# EAGLE design rpi2_brkout (EAGLE 7.7.0)
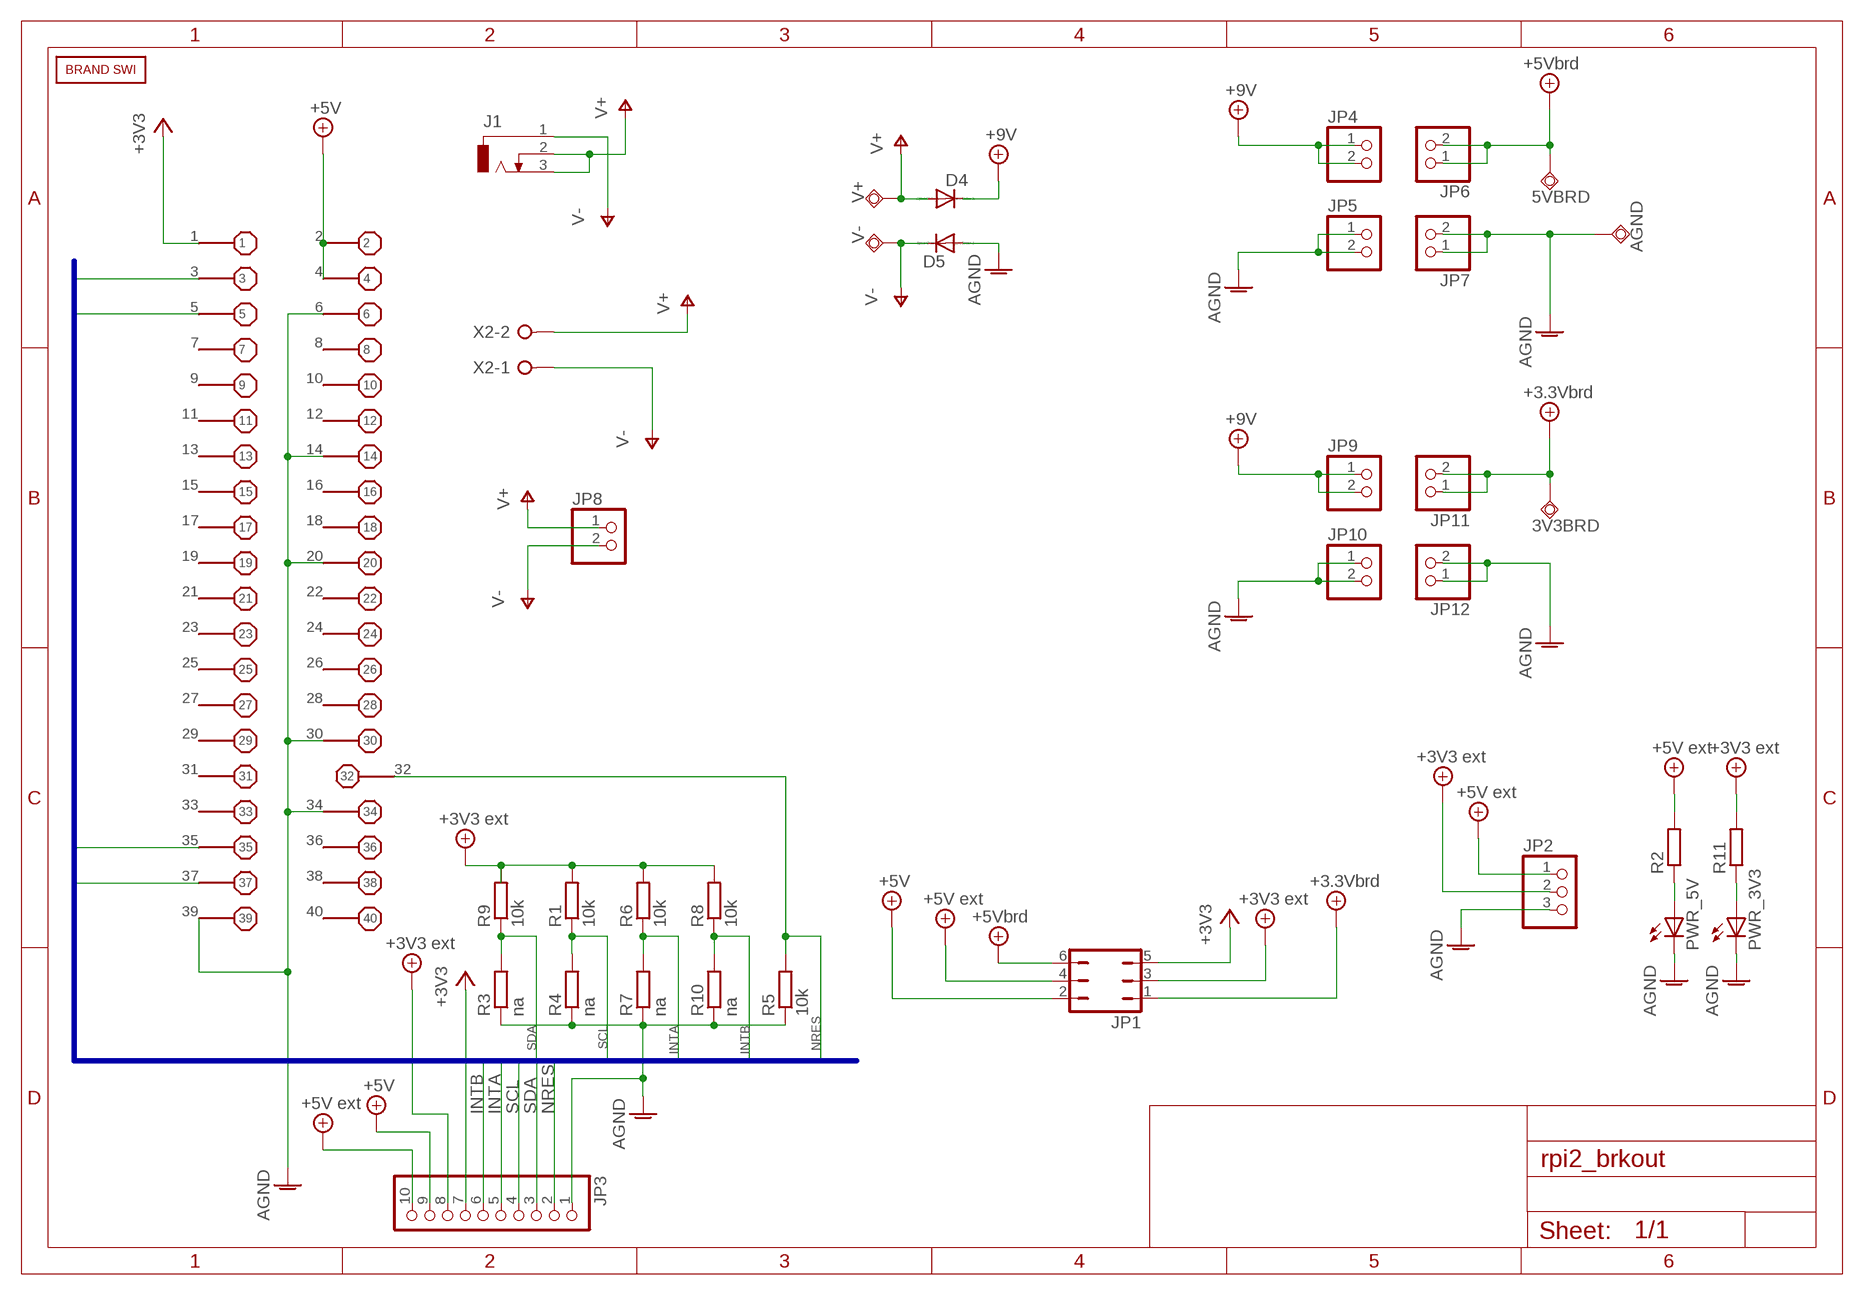
[diagram p0: schematic, sheet 1]

## Parts
3V3BRD  TPSQTP20SQ  [TP20SQ]
5VBRD  TPSQTP20SQ  [TP20SQ]
AGND  TPSQTP20SQ  [TP20SQ]
D4  1N4148DO35-7  [DO35-7]
D5  1N4148DO35-7  [DO35-7]
J1  DCJ0303  [DCJ0303]
JP1  JP3Q  [JP3Q]
JP2  PINHD-1X3  [1X03]
JP3  PINHD-1X10  [1X10]
JP4  PINHD-1X2  [1X02]
JP5  PINHD-1X2  [1X02]
JP6  PINHD-1X2  [1X02]
JP7  PINHD-1X2  [1X02]
JP8  PINHD-1X2  [1X02]
JP9  PINHD-1X2  [1X02]
JP10  PINHD-1X2  [1X02]
JP11  PINHD-1X2  [1X02]
JP12  PINHD-1X2  [1X02]
PWR_3V3  LEDCHIP-LED0805  [CHIP-LED0805]
PWR_5V  LEDCHIP-LED0805  [CHIP-LED0805]
R1  10k  R-EU_R0805  [R0805]
R2  R-EU_R0805  [R0805]
R3  na  R-EU_R0805  [R0805]
R4  na  R-EU_R0805  [R0805]
R5  10k  R-EU_R0805  [R0805]
R6  10k  R-EU_R0805  [R0805]
R7  na  R-EU_R0805  [R0805]
R8  10k  R-EU_R0805  [R0805]
R9  10k  R-EU_R0805  [R0805]
R10  na  R-EU_R0805  [R0805]
R11  R-EU_R0805  [R0805]
U$1  BRAND_SWI  [BRAND_SWI]
V+  TPSQTP20SQ  [TP20SQ]
V-  TPSQTP20SQ  [TP20SQ]
X1  B+_GPIO  [B+_GPIO]
X2  W237-02P  [W237-132]

## Nets
3.3VEXT: R1.2 R6.2 R8.2 R9.2 ; supply symbol labelled +3V3 ext
+3V3: JP1.5 JP3.7 X1.1
+5V: JP1.2 JP3.9 X1.2 X1.4
+5V/1: JP1.4 JP2.1 JP3.10 R2.2 ; supply symbol labelled +5V ext
+5V/2: JP1.3 JP2.2 JP3.8 R11.2 ; supply symbol labelled +3V3 ext
+5V/3: 3V3BRD.TP JP1.1 JP11.1 JP11.2 ; supply symbol labelled +3.3Vbrd
+5V/4: 5VBRD.TP JP1.6 JP6.1 JP6.2 ; supply symbol labelled +5Vbrd
+9V: D4.C JP4.1 JP4.2 JP9.1 JP9.2
AGND: AGND.TP D5.A JP2.3 JP3.1 JP5.1 JP5.2 JP7.1 JP7.2 JP10.1 JP10.2 JP12.1 JP12.2 PWR_3V3.C PWR_5V.C R3.1 R4.1 R5.1 R7.1 R10.1 X1.6 X1.14 X1.20 X1.30 X1.34 X1.39
INTA: JP3.5 R6.1 R7.2 X1.37
INTB: JP3.6 R8.1 R10.2 X1.35
N$1: PWR_3V3.A R11.1
N$31: PWR_5V.A R2.1
NRES: JP3.2 R5.2 X1.32
SCL: JP3.4 R1.1 R4.2 X1.5
SDA: JP3.3 R3.2 R9.1 X1.3
V+: D4.A J1.2 J1.3 JP8.1 V+.TP X2.2
V-: D5.C J1.1 JP8.2 V-.TP X2.1
Unconnected: X1.7 X1.8 X1.9 X1.10 X1.11 X1.12 X1.13 X1.15 X1.16 X1.17 X1.18 X1.19 X1.21 X1.22 X1.23 X1.24 X1.25 X1.26 X1.27 X1.28 X1.29 X1.31 X1.33 X1.36 X1.38 X1.40

## Buses
INTA,INTB,SCL,SDA,NRES

## Library data of the parts
3V3BRD 5VBRD AGND V+ V- = testpad:TPSQ: Test pad
D4 D5 = diode:1N4148: DIODE high speed (Philips)
J1 = con-jack:DCJ0303: DC POWER JACK Source: DCJ0303.pdf; OC_FARNELL: unknown; OC_NEWARK: unknown
JP1 = jumper:JP3Q: JUMPER
JP2 = pinhead:PINHD-1X3: PIN HEADER
JP3 = pinhead:PINHD-1X10: PIN HEADER
JP4-JP12 = pinhead:PINHD-1X2: PIN HEADER
PWR_3V3 PWR_5V = led:LED: LED OSRAM: - CHIPLED LG R971, LG N971, LY N971, LG Q971, LY Q971, LO R971, LY R971 LH N974, LH R974 LS Q976, LO Q976, LY Q976 LO Q996 - Hyper CHIPLED LW Q18S LB Q993, LB Q99A, LB R99A - SideLED LS A670, LO A670, LY A670, LG A670, LP A670 LB A673, LV A673, LT A673, LW A673 LH A674 LY A675 LS A676, LA A676, LO A676, LY A676, LW A676 LS A679, LY A679, LG A679 - Hyper Micro SIDELED® LS Y876, LA Y876, LO Y876, LY Y876 LT Y87S - SmartLED LW L88C, LW L88S LB L89C, LB L89S, LG L890 LS L89K, LO L89K, LY L89K LS L896, LA L896, LO L896, LY L896 - TOPLED LS T670, LO T670, LY T670, LG T670, LP T670 LSG T670, LSP T670, LSY T670, LOP T670, LYG T670 LG T671, LOG T671, LSG T671 LB T673, LV T673, LT T673, LW T673 LH T674 LS T676, LA T676, LO T676, LY T676, LB T676, LH T676, LSB T676, LW T676 LB T67C, LV T67C, LT T67C, LS T67K, LO T67K, LY T67K, LW E67C LS E67B, LA E67B, LO E67B, LY E67B, LB E67C, LV E67C, LT E67C LW T67C LS T679, LY T679, LG T679 LS T770, LO T770, LY T770, LG T770, LP T770 LB T773, LV T773, LT T773, LW T773 LH T774 LS E675, LA E675, LY E675, LS T675 LS T776, LA T776, LO T776, LY T776, LB T776 LHGB T686 LT T68C, LB T68C - Hyper Mini TOPLED® LB M676 - Mini TOPLED Santana® LG M470 LS M47K, LO M47K, LY M47K Source: http://www.osram.convergy.de LUXEON: - LUMILED® LXK2-PW12-R00, LXK2-PW12-S00, LXK2-PW14-U00, LXK2-PW14-V00 LXK2-PM12-R00, LXK2-PM12-S00, LXK2-PM14-U00 LXK2-PE12-Q00, LXK2-PE12-R00, LXK2-PE12-S00, LXK2-PE14-T00, LXK2-PE14-U00 LXK2-PB12-K00, LXK2-PB12-L00, LXK2-PB12-M00, LXK2-PB14-N00, LXK2-PB14-P00, LXK2-PB14-Q00 LXK2-PR12-L00, LXK2-PR12-M00, LXK2-PR14-Q00, LXK2-PR14-R00 LXK2-PD12-Q00, LXK2-PD12-R00, LXK2-PD12-S00 LXK2-PH12-R00, LXK2-PH12-S00 LXK2-PL12-P00, LXK2-PL12-Q00, LXK2-PL12-R00 Source: www.luxeon.com KINGBRIGHT: KA-3528ASYC Source: www.kingbright.com
R1-R11 = rcl:R-EU_: RESISTOR, European symbol
U$1 = BRAND_SWI:BRAND_SWI
X1 = raspberry:B+_GPIO
X2 = con-wago-508:W237-02P: WAGO SREW CLAMP; OC_FARNELL: unknown; OC_NEWARK: unknown

## Board
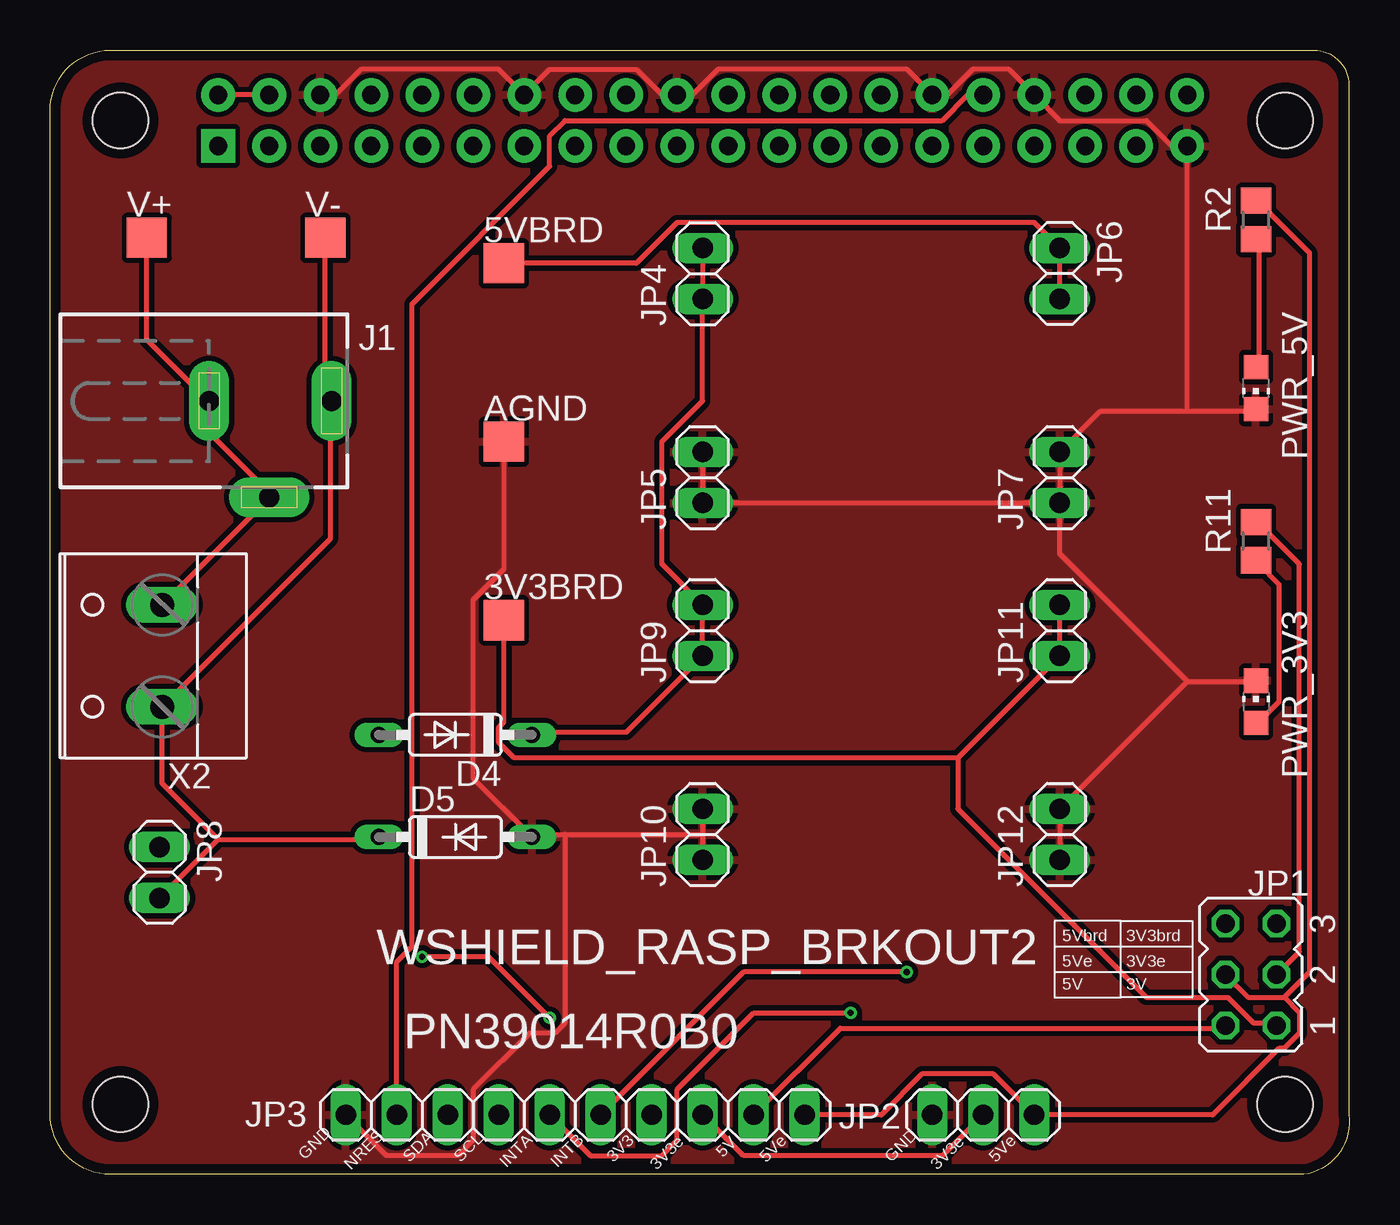
[diagram p1: board, top side]
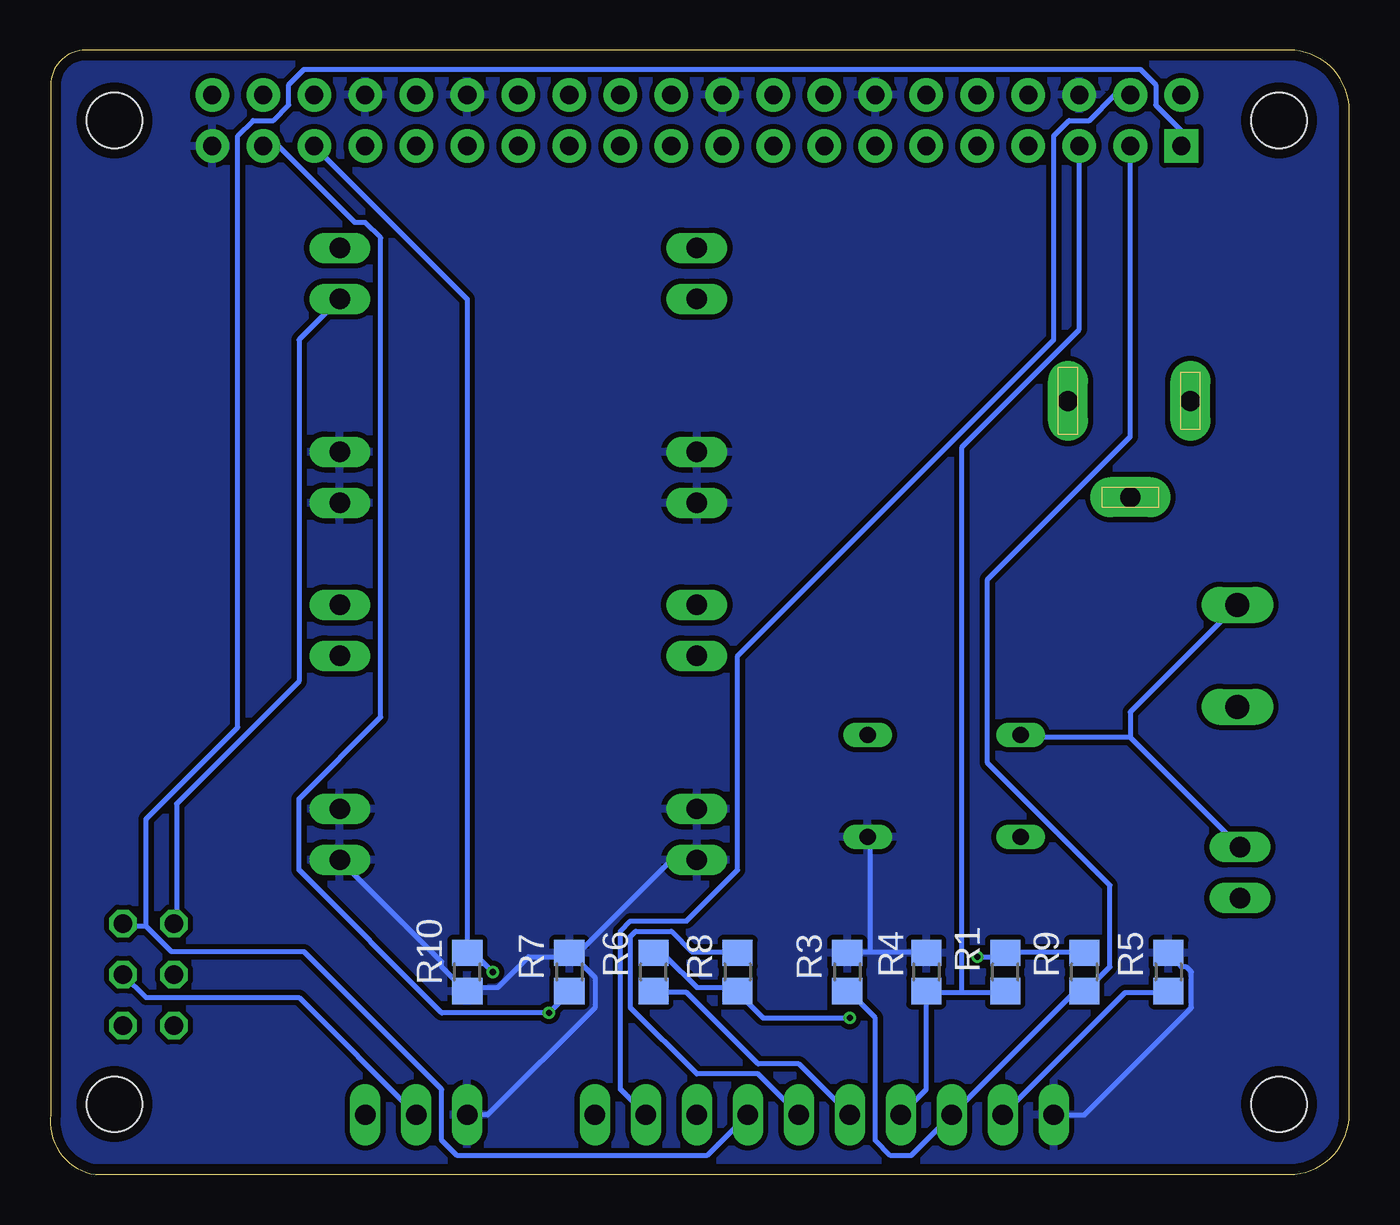
[diagram p2: board, bottom side, seen from below]

Size 64.71 x 56 mm. Coordinates in mm from the lower left corner, seen from the top.
Outline: 0,53 arc-90 3,56 62.95,56 arc-90 64.68,54.27 64.68,3 arc-90 62.44,0 3,0 arc-90 0,3 0,53
Copper layers (1*16): Top 0.035mm / dielectric 1.6mm / Bottom 0.035mm
Design rules "Elecrow_2-layer_PCB_eagle_rule *": minimum track width 10mil, minimum drill 12mil, track to track 10mil, track to pad 10mil, pad to pad 6mil, via to via 8mil, smd to smd 0mil, copper to edge 20mil, drill to drill 10mil, minimum pad ring 6mil, minimum via ring 6mil, stop-mask expansion 0mil, vias tented up to drill 100mil, thermal gap 10mil
Holes 2.75 mm at 3.5,52.5 3.5,3.5 61.5,52.5 61.5,3.5

### Footprints (pad centres in the part's own frame; a part is rotated, then mirrored left to right if it is on the bottom)
TP20SQ = smd 2 x 2: TP 0,0
DO35-7 = drill 0.813 long: A 3.81,0; C -3.81,0
DCJ0303 = drill 1 pad 2 long: 1 0,3.1; 2 4.8,0; 3 0,-3
JP3Q = drill 0.914 octagon: 1 -2.54,-1.27; 2 -2.54,1.27; 3 0,-1.27; 4 0,1.27; 5 2.54,-1.27; 6 2.54,1.27
1X03 = drill 1.016 long: 1 -2.54,0; 2 0,0; 3 2.54,0
1X10 = drill 1.016 long: 1 -11.43,0; 2 -8.89,0; 3 -6.35,0; 4 -3.81,0; 5 -1.27,0; 6 1.27,0; 7 3.81,0; 8 6.35,0; 9 8.89,0; 10 11.43,0
1X02 = drill 1.016 long: 1 -1.27,0; 2 1.27,0
CHIP-LED0805 = smd 1.2 x 1.2: A 0,-1.05; C 0,1.05
R0805 = smd 1.3 x 1.5: 1 -0.95,0; 2 0.95,0
B+_GPIO = drill 0.9 pad 1.676 square: 1 -24.13,-1.27 | drill 0.9 pad 1.676: 2 -24.13,1.27; 3 -21.59,-1.27; 4 -21.59,1.27; 5 -19.05,-1.27; 6 -19.05,1.27; 7 -16.51,-1.27; 8 -16.51,1.27; 9 -13.97,-1.27; 10 -13.97,1.27; 11 -11.43,-1.27; 12 -11.43,1.27; 13 -8.89,-1.27; 14 -8.89,1.27; 15 -6.35,-1.27; 16 -6.35,1.27; 17 -3.81,-1.27; 18 -3.81,1.27; 19 -1.27,-1.27; 20 -1.27,1.27; 21 1.27,-1.27; 22 1.27,1.27; 23 3.81,-1.27; 24 3.81,1.27; 25 6.35,-1.27; 26 6.35,1.27; 27 8.89,-1.27; 28 8.89,1.27; 29 11.43,-1.27; 30 11.43,1.27; 31 13.97,-1.27; 32 13.97,1.27; 33 16.51,-1.27; 34 16.51,1.27; 35 19.05,-1.27; 36 19.05,1.27; 37 21.59,-1.27; 38 21.59,1.27; 39 24.13,-1.27; 40 24.13,1.27
W237-132 = drill 1.194 long: 1 -2.54,-0.635; 2 2.54,-0.635

### Placement (x,y rotation side)
3V3BRD  22.59,27.61 0 top
5VBRD  22.59,45.39 0 top
AGND  22.59,36.5 0 top
D4  20.18,21.89 180 top
D5  20.18,16.81 0 top
J1  10.91,38.53 270 top
JP1  59.8,9.96 90 top
JP2  46.47,2.97 180 top
JP3  26.15,2.97 0 top
JP4  32.5,44.88 90 top
JP5  32.5,34.72 90 top
JP6  50.28,44.88 270 top
JP7  50.28,34.72 90 top
JP8  5.45,15.04 270 top
JP9  32.5,27.1 90 top
JP10  32.5,16.94 90 top
JP11  50.28,27.1 90 top
JP12  50.28,16.94 90 top
PWR_3V3  60.06,23.54 0 top
PWR_5V  60.06,39.16 180 top
R1  17.13,10.08 90 bottom
R2  60.06,47.55 90 top
R3  25.01,10.08 270 bottom
R4  21.07,10.08 270 bottom
R5  9,10.08 270 bottom
R6  34.66,10.08 90 bottom
R7  38.85,10.08 270 bottom
R8  30.47,10.08 270 bottom
R9  13.2,10.08 90 bottom
R10  43.93,10.08 90 bottom
R11  60.06,31.55 90 top
U$1  8.75,6.15 0 top
V+  4.81,46.66 0 top
V-  13.7,46.66 0 top
X1  32.5,52.5 0 top
X2  4.94,25.83 90 top

### Tracks (layer width: path | path; a pad name or v marks a point on that pad's centre or on a via)
3.3VEXT  (via drill 0.3)
  Top 0.254: v18.53,10.84 21.83,10.84 v24.88,7.8
  Bottom 0.254: R9.2 13.2,11.1 17.01,11.1 R1.2 17.26,10.84 v18.53,10.84 | R6.2 34.53,10.84 34.02,10.84 32.5,9.32 30.47,9.32 R8.2 30.47,9.07 29.2,7.8 v24.88,7.8
+3V3
  Bottom 0.254: 59.93,12.37 60.95,12.37 JP1.5 | 59.93,12.37 58.66,11.1 52.06,11.1 45.2,4.24 45.2,1.7 44.44,0.94 31.99,0.94 JP3.7 | X1.1 8.37,51.99 9.64,53.26 9.64,54.28 10.4,55.04 52.06,55.04 52.82,54.28 52.82,53.26 53.58,52.5 54.6,52.5 55.36,51.74 55.36,22.27 59.93,17.7 59.93,12.37
+5V
  Top 0.254: X1.4 X1.2 | JP3.9 39.36,7.29 58.41,7.29 JP1.2
  Bottom 0.254: X1.4 11.67,53.77 12.94,52.5 13.96,52.5 14.72,51.74 14.72,41.58 30.47,25.83 30.47,15.16 33.01,12.62 35.8,12.62 36.31,12.11 36.31,4.24 JP3.9
+5V/1
  Top 0.254: JP3.10 41.39,2.97 43.42,5 46.98,5 JP2.1 57.9,2.97 61.2,6.27 61.46,6.27 62.22,7.03 62.22,8.05 61.46,8.81 | 61.46,8.81 62.73,10.08 62.73,45.9 60.19,48.44 R2.2 | 61.46,8.81 59.68,8.81 JP1.4
+5V/2
  Top 0.254: JP3.8 34.53,0.94 44.44,0.94 JP2.2 | JP1.3 62.22,11.1 62.22,30.4 60.19,32.43 R11.2
  Bottom 0.254: JP2.2 52.31,8.81 59.93,8.81 JP1.3
+5V/3
  Top 0.254: 61.2,7.44 JP1.1 60.95,7.54 59.93,7.54 58.66,8.81 54.6,8.81 45.2,18.21 45.2,20.75 | 3V3BRD.TP 22.59,22.53 22.34,22.27 22.34,21.51 23.1,20.75 45.2,20.75 | 45.2,20.75 JP11.1 JP11.2
+5V/4
  Top 0.254: 5VBRD.TP 29.2,45.39 31.23,47.42 49.01,47.42 JP6.1 JP6.2
  Bottom 0.254: JP6.2 52.31,41.58 52.31,24.56 58.41,18.46 58.41,12.62 JP1.6
+9V
  Top 0.254: JP4.2 JP4.1 32.5,38.53 30.47,36.5 30.47,30.4 JP9.2 JP9.1 28.69,22.02 24.12,22.02 D4.C
AGND
  Top 0.254: X1.6 14.21,53.77 15.48,55.04 22.34,55.04 X1.14 24.88,55.04 29.2,55.04 30.47,53.77 X1.20 31.99,53.77 33.26,55.04 42.66,55.04 X1.30 44.69,53.77 45.96,55.04 47.74,55.04 X1.34 50.28,52.5 54.6,52.5 55.87,51.23 X1.39 56.63,38.02 | JP5.2 JP5.1 JP7.1 | 56.63,38.02 52.31,38.02 JP7.2 JP7.1 | 56.63,38.02 59.93,38.02 PWR_5V.C | 56.63,24.56 59.93,24.56 PWR_3V3.C | 56.63,24.56 JP12.2 JP12.1 | JP10.2 32.5,16.94 | 32.5,16.94 JP10.1 | AGND.TP 22.59,30.15 21.07,28.62 21.07,19.73 D5.A 24.12,16.94 25.64,16.94 | 25.64,16.94 32.5,16.94 | JP3.1 16.75,0.94 20.31,0.94 21.07,1.7 21.07,4.24 23.86,7.03 25.13,7.03 25.64,7.54 25.64,16.94 | JP7.1 50.28,30.91 56.63,24.56
  Bottom 0.254: JP3.1 13.2,2.97 7.86,8.3 7.86,10.08 8.12,10.34 8.37,10.34 8.88,10.84 R5.1 | R7.1 38.85,10.84 40.88,10.84 42.41,9.32 43.93,9.32 R10.1 43.93,9.07 45.2,10.34 45.2,10.59 JP12.1 | JP2.3 42.91,2.97 37.58,8.3 37.58,9.83 38.6,10.84 | 38.6,10.84 38.85,11.1 R7.1 | 23.86,11.1 24.88,11.1 R3.1 | 23.86,11.1 21.07,11.1 R4.1 | 23.86,11.1 23.86,16.69 D5.A | 38.6,10.84 33.77,15.67 JP10.1 | 38.6,10.84 R7.1
  pour Top (isolate 0.254): -0.01,31.93 -0.01,53.26 arc-90 2.78,56.06 3.8,56.06 63.23,56.06 arc-90 64.76,54.53 64.76,53.77 64.76,3.22 arc-90 61.46,-0.08 61.2,-0.08 3.54,-0.08 arc-90 -0.01,3.48 -0.01,3.73
  pour Bottom (isolate 0.254): -0.01,32.94 -0.01,53.26 arc-90 2.78,56.06 3.54,56.06 63.23,56.06 arc-90 64.76,54.53 64.76,54.28 64.76,2.97 arc-90 61.71,-0.08 61.46,-0.08 3.29,-0.08 arc-90 -0.01,3.22
INTA  (via drill 0.3)
  Top 0.254: v39.87,8.05 35.04,8.05 31.23,4.24 31.23,1.7 30.47,0.94 26.91,0.94 JP3.5
  Bottom 0.254: JP3.5 27.42,5.51 29.45,5.51 33.01,9.07 34.53,9.07 R6.1 | R7.2 38.85,9.07 v39.87,8.05 45.2,8.05 52.31,15.16 52.31,18.72 48.25,22.78 48.25,46.66 49.01,47.42 49.52,47.42 53.33,51.23 X1.37
INTB  (via drill 0.3)
  Top 0.254: JP3.6 34.53,10.08 v42.66,10.08
  Bottom 0.254: JP3.6 29.45,5 32.5,5 35.8,8.3 35.8,11.86 35.55,12.11 33.77,12.11 32.75,11.1 30.47,11.1 R8.1 | 43.93,11.35 43.93,43.61 X1.35 | 43.93,11.35 R10.2 43.93,11.1 | 43.93,11.35 v42.66,10.08
N$1
  Top 0.254: PWR_3V3.A 60.19,22.53 61.2,23.54 61.2,29.39 60.19,30.4 R11.1
N$31
  Top 0.254: PWR_5V.A 60.19,40.31 60.19,46.4 R2.1
NRES
  Top 0.254: X1.32 45.71,53.77 44.44,52.5 25.64,52.5 24.88,51.74 24.88,50.21 18.02,43.36 18.02,11.35 17.26,10.59 JP3.2
  Bottom 0.254: JP3.2 11.16,9.07 9.13,9.07 R5.2
SCL
  Bottom 0.254: 21.07,9.07 19.29,9.07 | 19.29,9.07 17.26,9.07 R1.1 | 21.07,9.07 21.07,4.24 JP3.4 | 21.07,9.07 R4.2 | X1.5 13.45,42.09 19.29,36.24 19.29,9.07
SDA
  Bottom 0.254: 13.2,9.07 13.7,9.07 JP3.3 21.83,0.94 22.85,0.94 23.61,1.7 23.61,7.8 24.88,9.07 R3.2 | X1.3 10.91,36.75 18.02,29.64 18.02,20.5 11.93,14.4 11.93,10.34 13.2,9.07 | 13.2,9.07 R9.1
V+
  Top 0.254: V+.TP 4.81,41.58 7.86,38.53 J1.3 8.12,38.53 8.12,36.75 10.91,33.96 J1.2 10.91,33.7 X2.2
  Bottom 0.254: 10.91,21.77 16.24,21.77 D4.A | JP8.1 10.91,21.77 | 10.91,21.77 10.91,23.04 X2.2
V-
  Top 0.254: V-.TP 13.7,38.78 13.96,38.53 | 8.37,16.69 16.24,16.69 D5.C | JP8.2 8.37,16.69 | 8.37,16.69 5.58,19.48 X2.1 13.96,31.67 13.96,38.53 | 13.96,38.53 J1.1

### Text on the board
tNames: 5Vbrd | 3V3brd | WSHIELD_RASP_BRKOUT2 | 5Ve | 3V3e | 5V | 3V | PN39014R0B0 | GND | SDA | SCL | 3V3 | 5V | 5Ve | GND | 5Ve | NRES | INTA | INTB | 3V3e | 3V3e